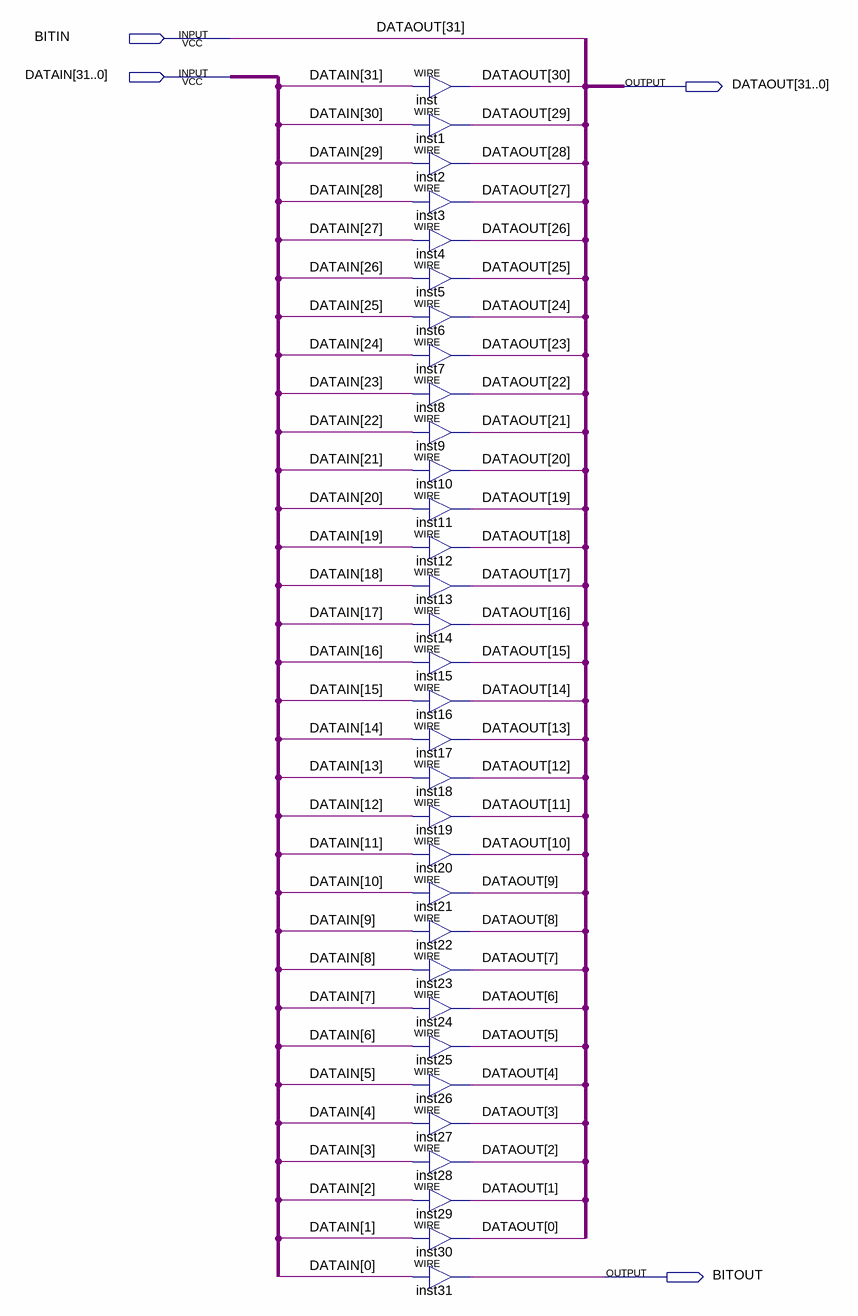
[diagram p0: schematic sheet]
// Quartus schematic SHIFTBOX.bdf as structural Verilog: 32 symbols, 4 pins
module SHIFTBOX (
  input  BITIN,
  input  [31:0] DATAIN,
  output [31:0] DATAOUT,
  output BITOUT
);

  assign DATAOUT[30] = DATAIN[31];  // WIRE inst
  assign DATAOUT[29] = DATAIN[30];  // WIRE inst1
  assign DATAOUT[28] = DATAIN[29];  // WIRE inst2
  assign DATAOUT[27] = DATAIN[28];  // WIRE inst3
  assign DATAOUT[26] = DATAIN[27];  // WIRE inst4
  assign DATAOUT[25] = DATAIN[26];  // WIRE inst5
  assign DATAOUT[24] = DATAIN[25];  // WIRE inst6
  assign DATAOUT[23] = DATAIN[24];  // WIRE inst7
  assign DATAOUT[22] = DATAIN[23];  // WIRE inst8
  assign DATAOUT[21] = DATAIN[22];  // WIRE inst9
  assign DATAOUT[20] = DATAIN[21];  // WIRE inst10
  assign DATAOUT[19] = DATAIN[20];  // WIRE inst11
  assign DATAOUT[18] = DATAIN[19];  // WIRE inst12
  assign DATAOUT[17] = DATAIN[18];  // WIRE inst13
  assign DATAOUT[16] = DATAIN[17];  // WIRE inst14
  assign DATAOUT[15] = DATAIN[16];  // WIRE inst15
  assign DATAOUT[14] = DATAIN[15];  // WIRE inst16
  assign DATAOUT[13] = DATAIN[14];  // WIRE inst17
  assign DATAOUT[12] = DATAIN[13];  // WIRE inst18
  assign DATAOUT[11] = DATAIN[12];  // WIRE inst19
  assign DATAOUT[10] = DATAIN[11];  // WIRE inst20
  assign DATAOUT[9] = DATAIN[10];  // WIRE inst21
  assign DATAOUT[8] = DATAIN[9];  // WIRE inst22
  assign DATAOUT[7] = DATAIN[8];  // WIRE inst23
  assign DATAOUT[6] = DATAIN[7];  // WIRE inst24
  assign DATAOUT[5] = DATAIN[6];  // WIRE inst25
  assign DATAOUT[4] = DATAIN[5];  // WIRE inst26
  assign DATAOUT[3] = DATAIN[4];  // WIRE inst27
  assign DATAOUT[2] = DATAIN[3];  // WIRE inst28
  assign DATAOUT[1] = DATAIN[2];  // WIRE inst29
  assign DATAOUT[0] = DATAIN[1];  // WIRE inst30
  assign BITOUT = DATAIN[0];  // WIRE inst31

  assign DATAOUT[31] = BITIN;
endmodule
